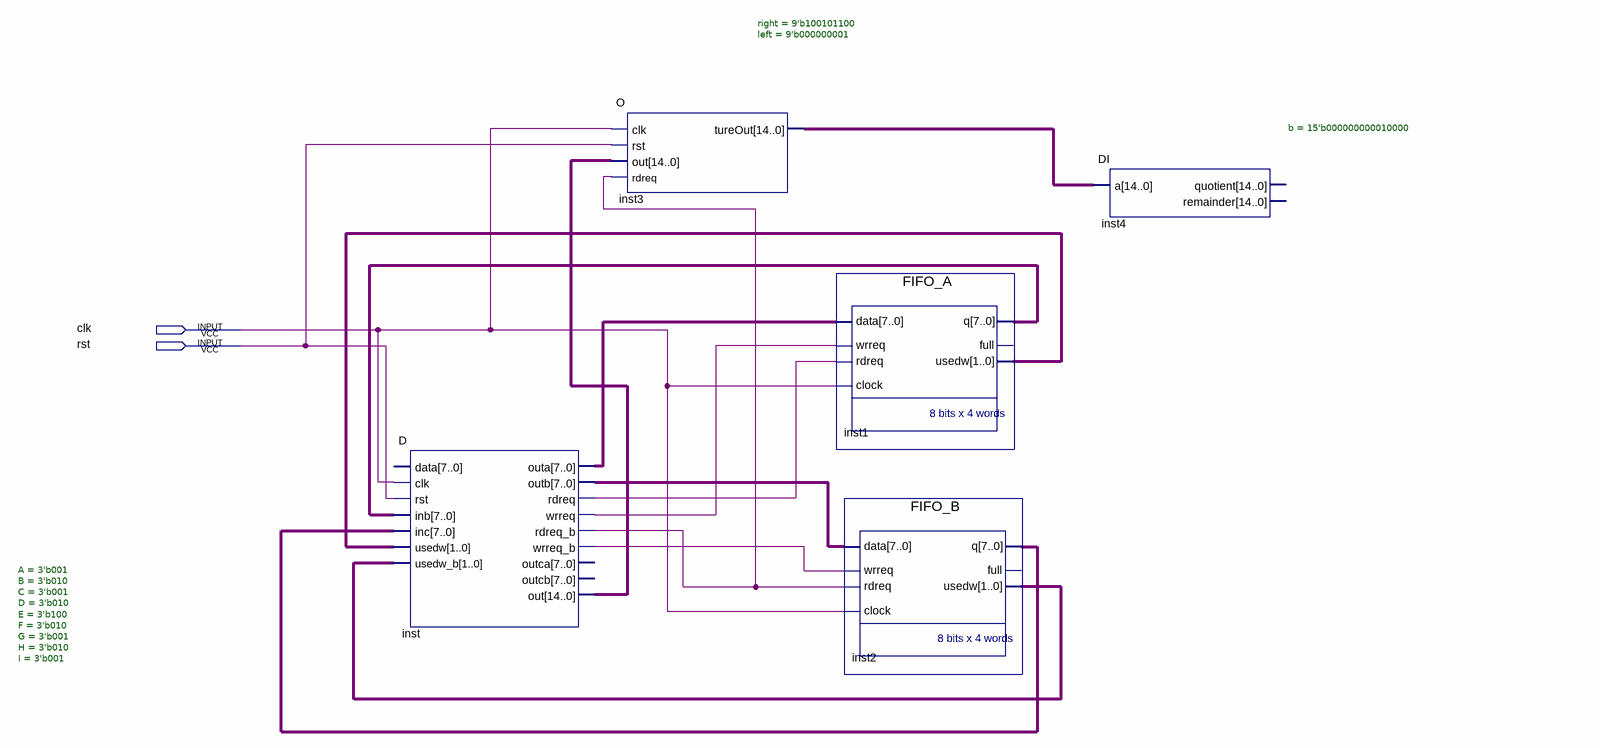
[diagram p0: schematic sheet]
// Quartus schematic Block2.bdf as structural Verilog: 5 symbols, 2 pins
module Block2 (
  input  clk,
  input  rst
);

  wire inst_rdreq, inst_rdreq_b, inst_wrreq, inst_wrreq_b;
  wire [1:0] inst1_usedw, inst2_usedw;
  wire [7:0] inst1_q, inst2_q, inst_outa, inst_outb;
  wire [14:0] inst3_tureout, inst_out;

  D #(.A(3'b001), .B(3'b010), .C(3'b001), .D(3'b010), .E(3'b100), .F(3'b010), .G(3'b001), .H(3'b010), .I(3'b001)) inst (
    .clk(clk), .rst(rst), .inb(inst1_q), .inc(inst2_q), .usedw(inst1_usedw), .usedw_b(inst2_usedw),
    .outa(inst_outa), .outb(inst_outb), .rdreq(inst_rdreq), .wrreq(inst_wrreq), .rdreq_b(inst_rdreq_b),
    .wrreq_b(inst_wrreq_b), .out(inst_out));  // open: data, outca, outcb
  O #(.right(9'b100101100), .left(9'b000000001)) inst3 (
    .clk(clk), .rst(rst), .out(inst_out), .rdreq(inst_rdreq_b), .tureOut(inst3_tureout));
  FIFO_A inst1 (
    .data(inst_outa), .wrreq(inst_wrreq), .rdreq(inst_rdreq), .clock(clk), .q(inst1_q), .usedw(inst1_usedw));  // open: full
  FIFO_B inst2 (
    .data(inst_outb), .wrreq(inst_wrreq_b), .rdreq(inst_rdreq_b), .clock(clk), .q(inst2_q),
    .usedw(inst2_usedw));  // open: full
  DI #(.b(15'b000000000010000)) inst4 (.a(inst3_tureout));  // open: quotient, remainder
endmodule
